# EAGLE design AquModule2 (EAGLE 6.6.0)
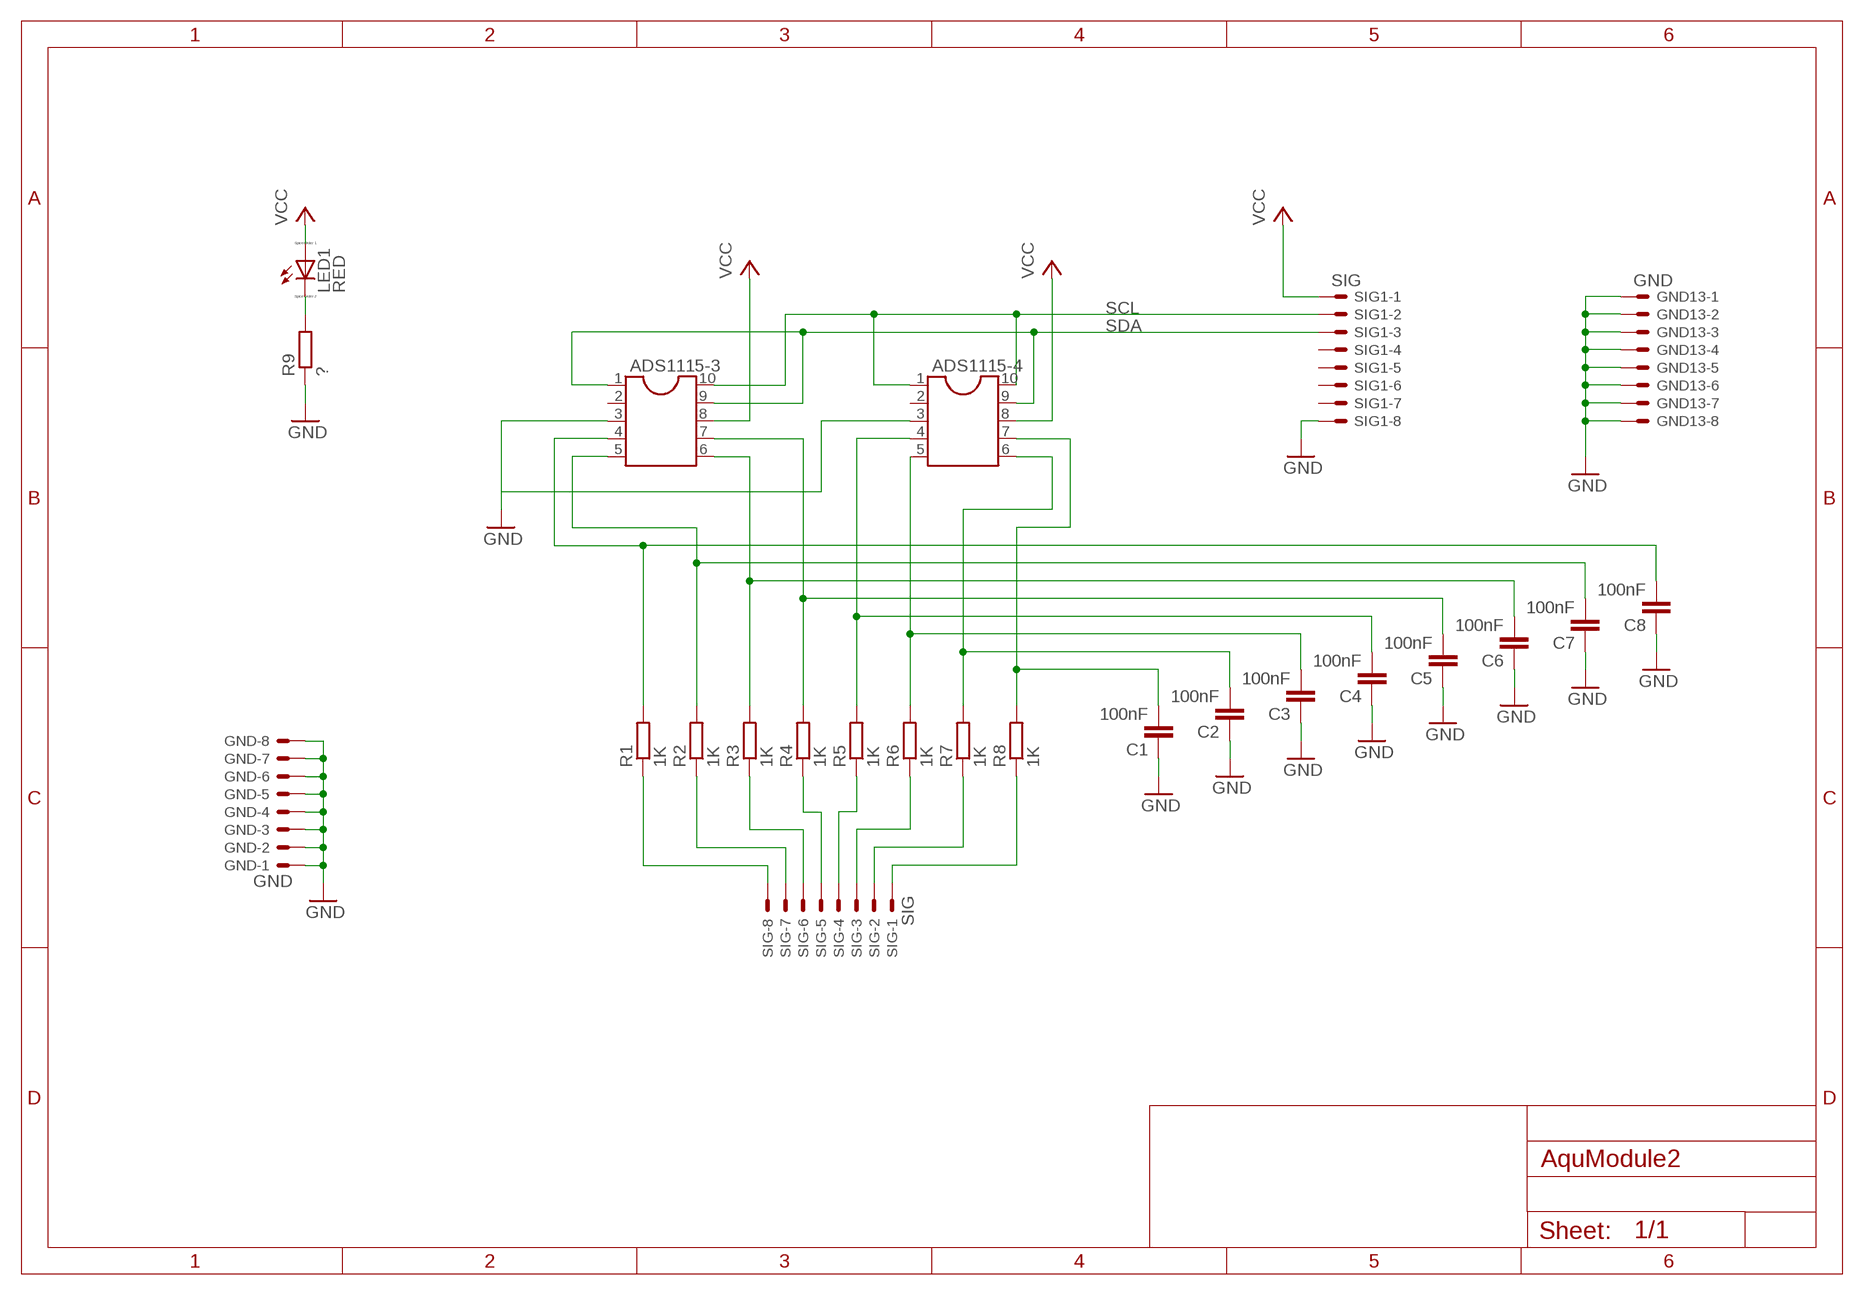
[diagram p0: schematic, sheet 1]

## Parts
ADS1115-3  DIL10  [DIL10]
ADS1115-4  DIL10  [DIL10]
C1  100nF  C-EUC1206  [C1206]
C2  100nF  C-EUC1206  [C1206]
C3  100nF  C-EUC1206  [C1206]
C4  100nF  C-EUC1206  [C1206]
C5  100nF  C-EUC1206  [C1206]
C6  100nF  C-EUC1206  [C1206]
C7  100nF  C-EUC1206  [C1206]
C8  100nF  C-EUC1206  [C1206]
GND  GND  C-GRID-08-15-91  [15-91-08]
GND13  GND  C-GRID-08-15-91  [15-91-08]
LED1  RED  LED_ELD260  [LED_LD260]
R1  1K  R-EU_R1206  [R1206]
R2  1K  R-EU_R1206  [R1206]
R3  1K  R-EU_R1206  [R1206]
R4  1K  R-EU_R1206  [R1206]
R5  1K  R-EU_R1206  [R1206]
R6  1K  R-EU_R1206  [R1206]
R7  1K  R-EU_R1206  [R1206]
R8  1K  R-EU_R1206  [R1206]
R9  ?  R-EU_0207/2V  [0207/2V]
SIG  SIG  C-GRID-08-15-91  [15-91-08]
SIG1  SIG  C-GRID-08-15-91  [15-91-08]

## Nets
GND: ADS1115-3.3 ADS1115-4.3 C1.1 C2.1 C3.1 C4.1 C5.1 C6.1 C7.1 C8.1 GND13.1 GND13.2 GND13.3 GND13.4 GND13.5 GND13.6 GND13.7 GND13.8 GND.1 GND.2 GND.3 GND.4 GND.5 GND.6 GND.7 GND.8 R9.1 SIG1.8
N$1: ADS1115-3.4 C8.2 R1.2
N$2: ADS1115-3.5 C7.2 R2.2
N$3: ADS1115-3.6 C6.2 R3.2
N$4: ADS1115-3.7 C5.2 R4.2
N$5: ADS1115-4.4 C4.2 R5.2
N$6: ADS1115-4.5 C3.2 R6.2
N$7: ADS1115-4.6 C2.2 R7.2
N$8: ADS1115-4.7 C1.2 R8.2
N$9: R1.1 SIG.8
N$10: R2.1 SIG.7
N$11: R3.1 SIG.6
N$12: R4.1 SIG.5
N$13: R5.1 SIG.4
N$14: R6.1 SIG.3
N$15: R7.1 SIG.2
N$16: R8.1 SIG.1
N$17: LED1.K(C) R9.2
SCL: ADS1115-3.10 ADS1115-4.1 ADS1115-4.10 SIG1.2
SDA: ADS1115-3.1 ADS1115-3.9 ADS1115-4.9 SIG1.3
VCC: ADS1115-3.8 ADS1115-4.8 LED1.A SIG1.1
Unconnected: ADS1115-3.2 ADS1115-4.2 SIG1.4 SIG1.5 SIG1.6 SIG1.7

## Library data of the parts
ADS1115-3 ADS1115-4 = ic-package:DIL10: Dual In Line / Socket
C1-C8 = rcl:C-EU: CAPACITOR, European symbol
GND GND13 SIG SIG1 = con-molex:C-GRID-08: CONNECTOR wire to board 2.54 mm (0.100") pitch header; OC_FARNELL: unknown; OC_NEWARK: unknown
LED1 = eagle-ltspice:LED_E: LED Source: http://www.osram.convergy.de Source: www.luxeon.com Source: www.kingbright.com; SPICEMODEL: NONE; SPICEPREFIX: D; SPICETYPE: diode
R1-R9 = resistor:R-EU_: RESISTOR, European symbol

## Board
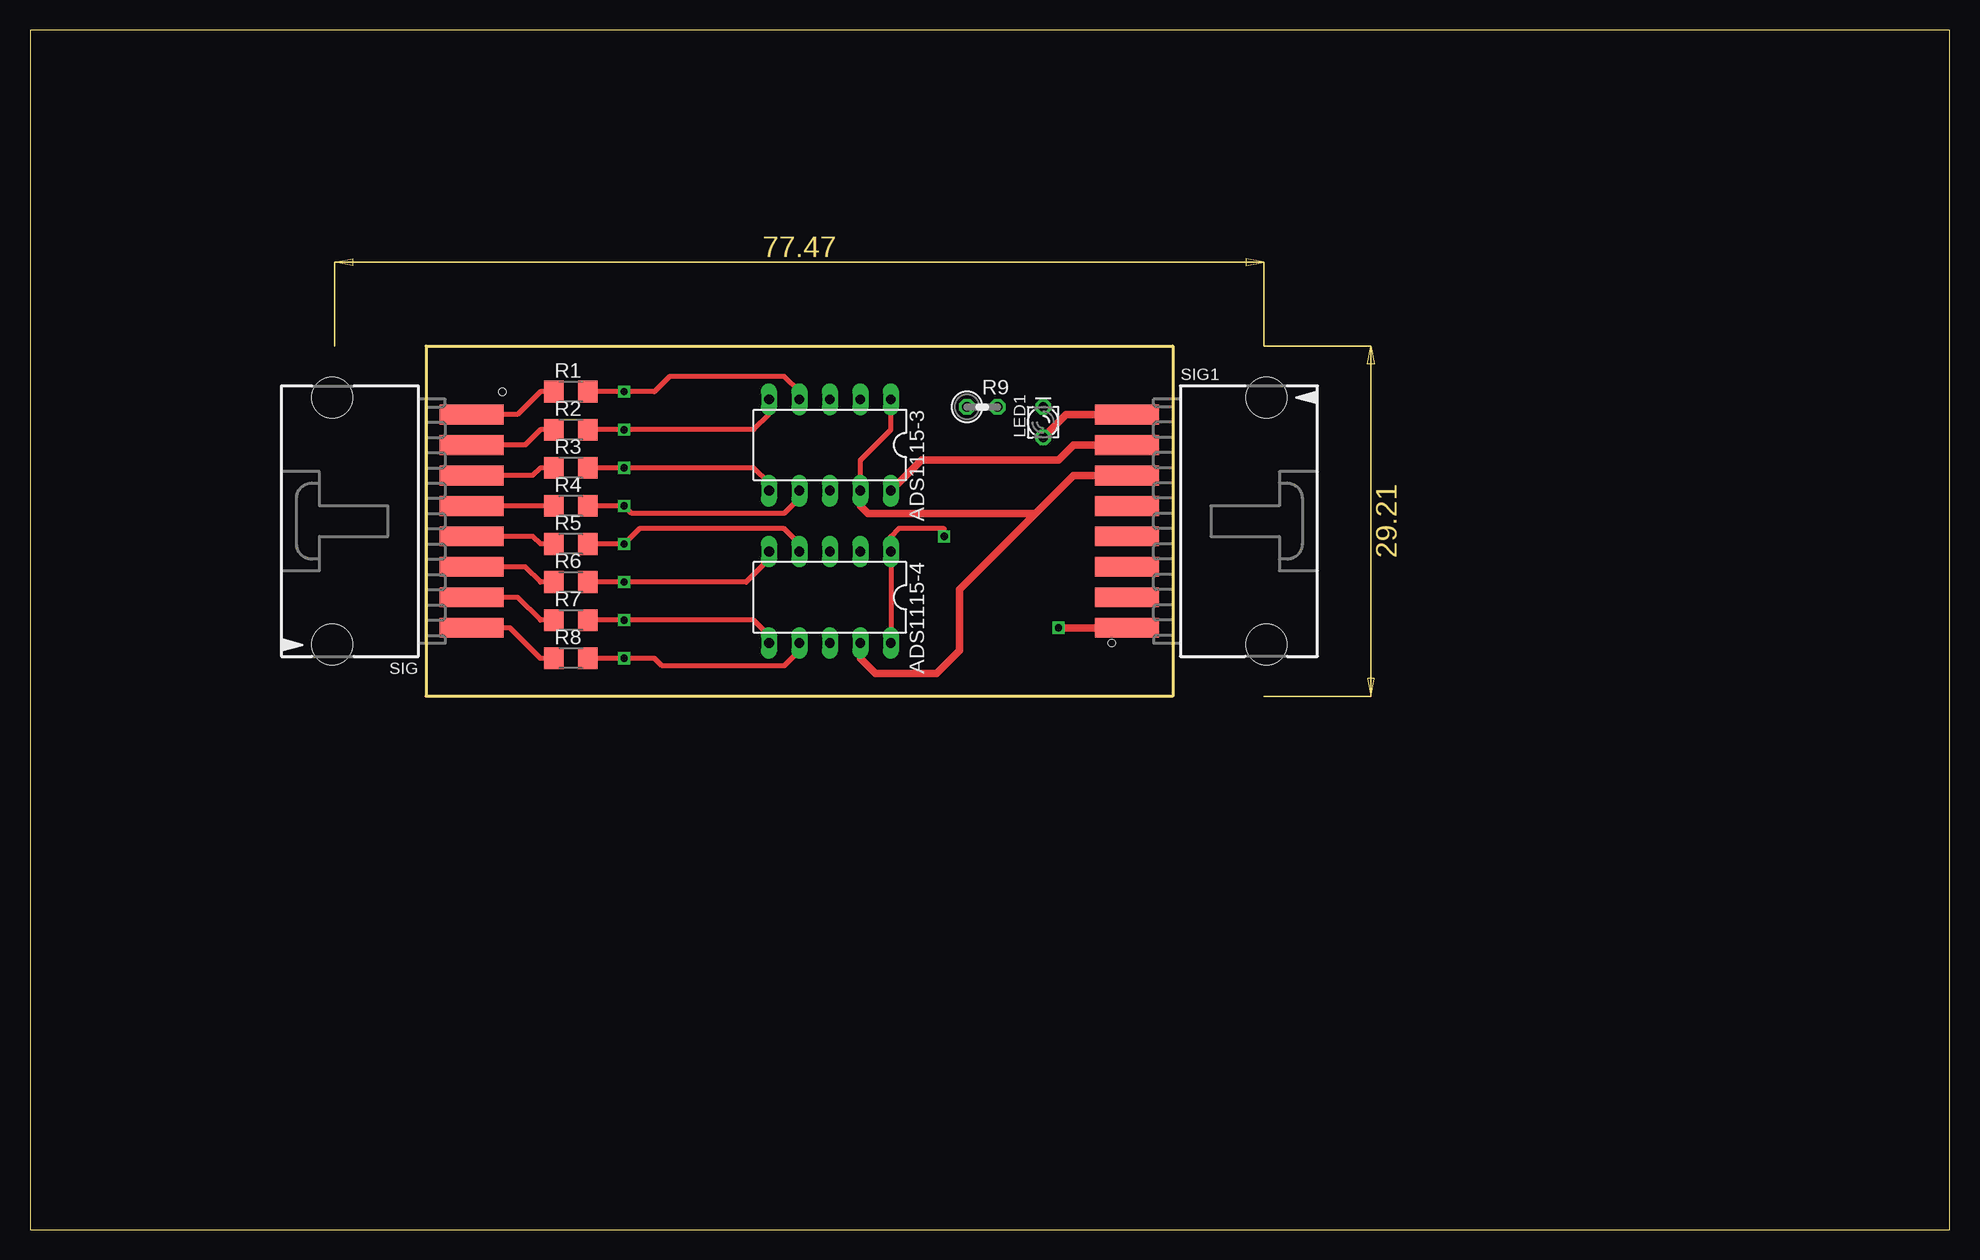
[diagram p1: board, top side]
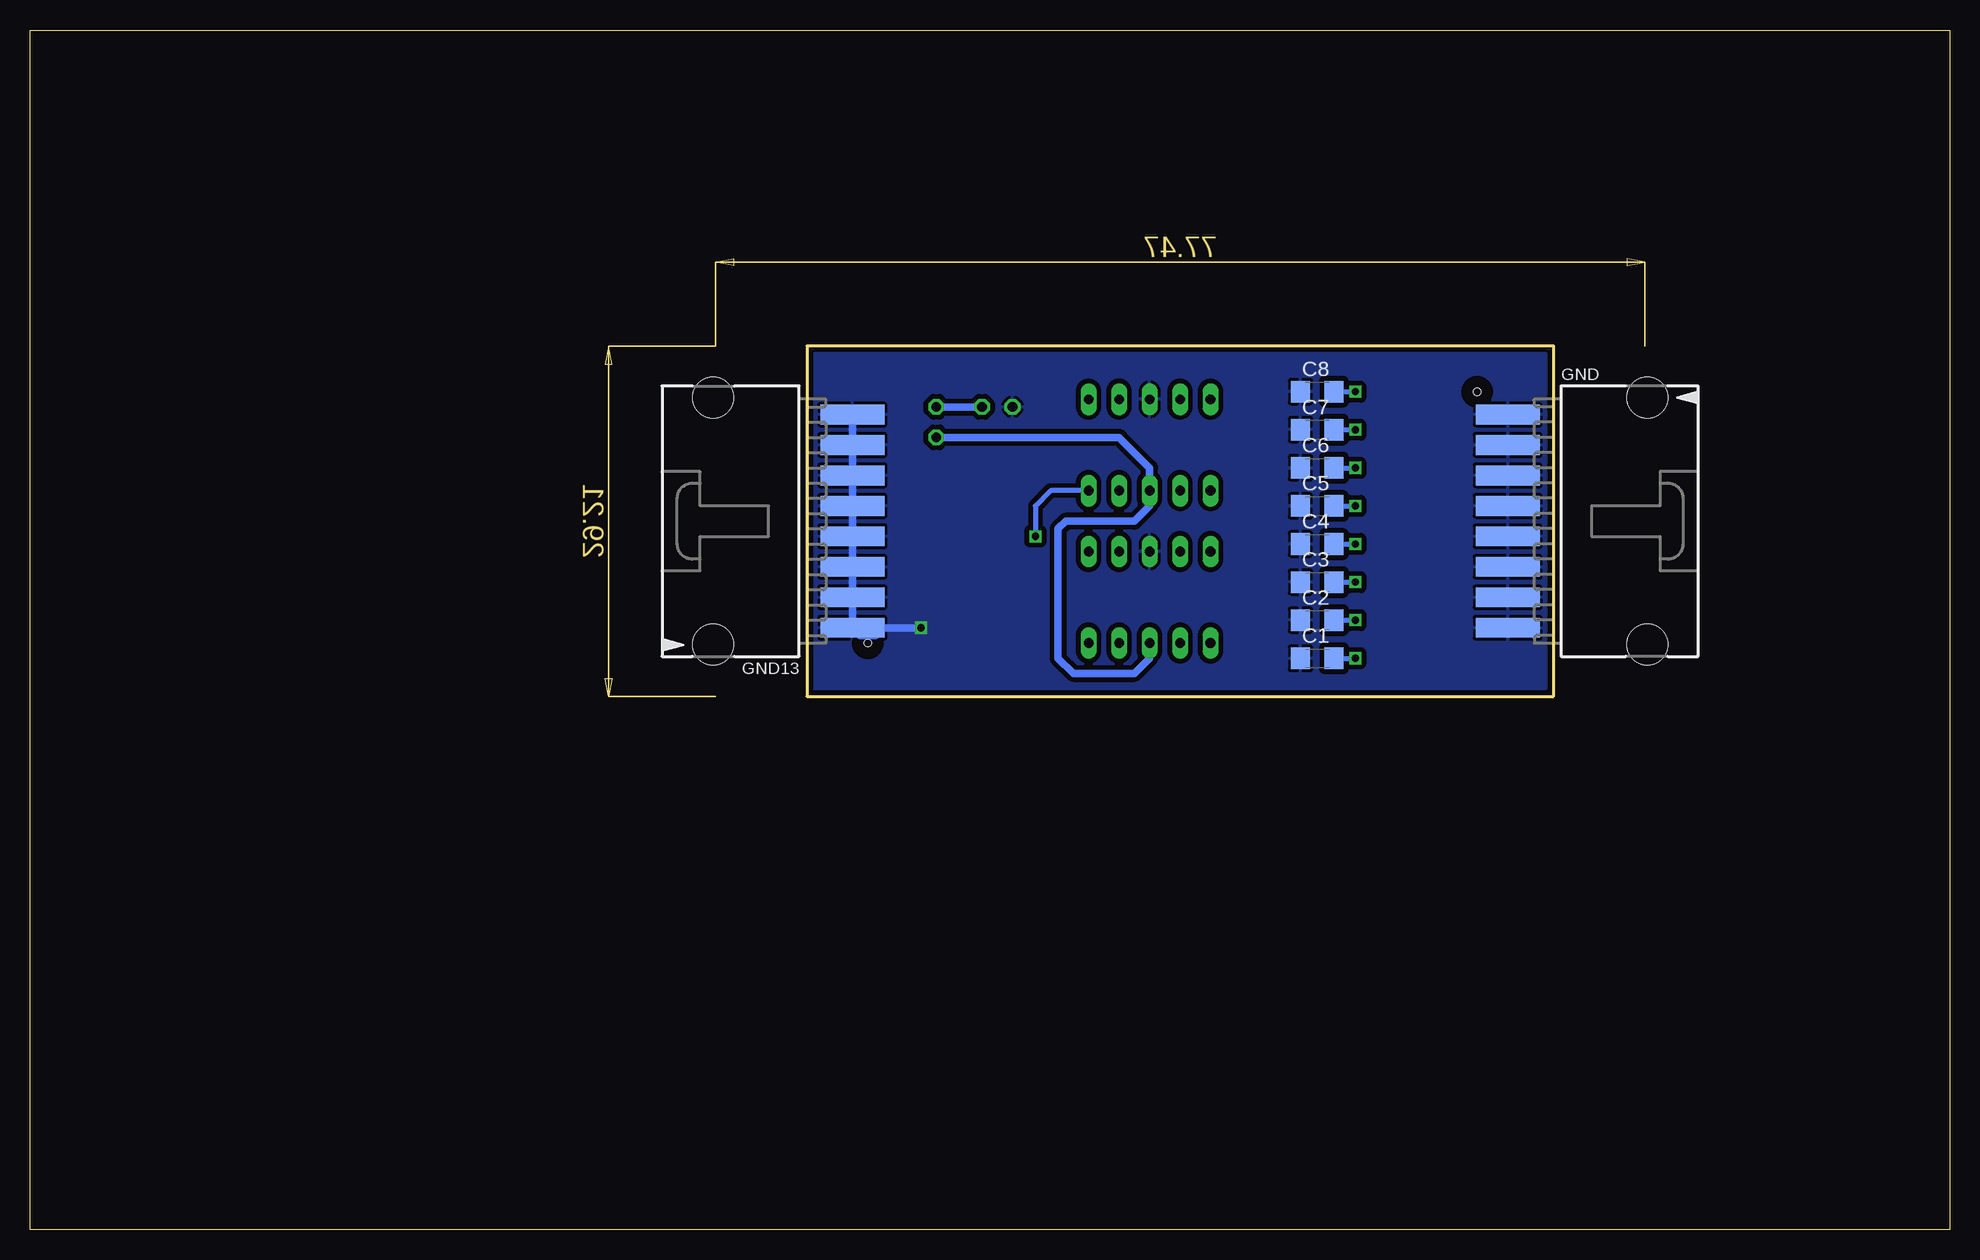
[diagram p2: board, bottom side, seen from below]

Size 160 x 100 mm. Coordinates in mm from the lower left corner, seen from the top.
Outline: 0,0 160,0 160,100 0,100 0,0
Copper layers (1*16): Top 0.035mm / dielectric 1.5mm / Bottom 0.035mm
Design rules "default": minimum track width 10mil, minimum drill 24mil, track to track 8mil, track to pad 8mil, pad to pad 8mil, via to via 8mil, smd to smd 8mil, copper to edge 40mil, drill to drill 8mil, minimum pad ring 10mil, minimum via ring 8mil, stop-mask expansion 4mil, vias tented up to drill 0mil, thermal gap 10mil
Holes 0.6 mm at 39.37,69.85 90.17,48.9
Milling: 4 lines

### Footprints (pad centres in the part's own frame; a part is rotated, then mirrored left to right if it is on the bottom)
DIL10 = drill 0.813 long: 1 -5.08,-3.81; 2 -2.54,-3.81; 3 0,-3.81; 4 2.54,-3.81; 5 5.08,-3.81; 6 5.08,3.81; 7 2.54,3.81; 8 0,3.81; 9 -2.54,3.81; 10 -5.08,3.81
C1206 = smd 1.6 x 1.8: 1 -1.4,0; 2 1.4,0
15-91-08 = smd 1.651 x 5.334: 1 -8.89,-10.795; 2 -6.35,-10.795; 3 -3.81,-10.795; 4 -1.27,-10.795; 5 1.27,-10.795; 6 3.81,-10.795; 7 6.35,-10.795; 8 8.89,-10.795 | hole 3.404: -10.287,0.838; 10.287,0.838
LED_LD260 = drill 0.813 octagon: A -1.27,0; K 1.27,0
R1206 = smd 1.6 x 1.803: 1 -1.422,0; 2 1.422,0
0207/2V = drill 0.813 octagon: 1 -1.27,0; 2 1.27,0

### Placement (x,y rotation side)
ADS1115-3  66.67,65.41 180 top
ADS1115-4  66.67,52.7 180 top
C1  52.7,47.62 0 bottom
C2  52.7,50.8 0 bottom
C3  52.7,53.98 0 bottom
C4  52.7,57.15 0 bottom
C5  52.7,60.33 0 bottom
C6  52.7,63.5 0 bottom
C7  52.7,66.67 0 bottom
C8  52.7,69.85 0 bottom
GND  26.04,59.05 270 bottom
GND13  102.23,59.05 90 bottom
LED1  84.45,67.31 90 top
R1  45.09,69.85 0 top
R2  45.09,66.67 0 top
R3  45.09,63.5 0 top
R4  45.09,60.33 0 top
R5  45.09,57.15 0 top
R6  45.09,53.98 0 top
R7  45.09,50.8 0 top
R8  45.09,47.62 0 top
R9  79.38,68.58 0 top
SIG  26.04,59.05 90 top
SIG1  102.23,59.05 270 top

### Tracks (layer width: path | path; a pad name or v marks a point on that pad's centre or on a via)
GND  (via drill 0.6)
  Top 0.61: v85.72,50.16 GND13.1
  Bottom 0.61: GND13.8 GND13.7 GND13.6 GND13.5 GND13.4 | 91.44,57.15 GND13.4 | GND13.4 GND13.3 GND13.2 GND13.1 | GND13.1 90.81,49.53 89.53,49.53 88.9,50.16 | GND13.1 v85.72,50.16
  pour Bottom (isolate 0.406): 33.66,73.03 94.61,73.03 94.61,45.09 33.66,45.09
N$1  (via drill 0.6)
  Top 0.406: R1.2 v49.53,69.85 52.05,69.85 53.33,71.12 62.87,71.12 64.14,69.85 ADS1115-3.4
  Bottom 0.406: C8.2 v49.53,69.85
N$2  (via drill 0.6)
  Top 0.406: R2.2 v49.53,66.67 60.33,66.67 61.59,67.94 ADS1115-3.5
  Bottom 0.406: C7.2 v49.53,66.67
N$3  (via drill 0.6)
  Top 0.406: R3.2 v49.53,63.5 60.33,63.5 61.59,62.23 ADS1115-3.6
  Bottom 0.406: C6.2 v49.53,63.5
N$4  (via drill 0.6)
  Top 0.406: R4.2 v49.53,60.33 50.16,59.69 62.87,59.69 64.14,60.96 ADS1115-3.7
  Bottom 0.406: C5.2 v49.53,60.33
N$5  (via drill 0.6)
  Top 0.406: R5.2 v49.53,57.15 50.8,58.42 62.87,58.42 64.14,57.15 ADS1115-4.4
  Bottom 0.406: C4.2 v49.53,57.15
N$6  (via drill 0.6)
  Top 0.406: R6.2 v49.53,53.98 59.69,53.98 61.59,55.88 ADS1115-4.5
  Bottom 0.406: C3.2 v49.53,53.98
N$7  (via drill 0.6)
  Top 0.406: R7.2 v49.53,50.8 60.33,50.8 61.59,49.53 ADS1115-4.6
  Bottom 0.406: C2.2 v49.53,50.8
N$8  (via drill 0.6)
  Top 0.406: R8.2 v49.53,47.62 52.05,47.62 52.69,46.99 62.87,46.99 64.14,48.26 ADS1115-4.7
  Bottom 0.406: C1.2 v49.53,47.62
N$9
  Top 0.406: R1.1 42.55,69.85 40.64,67.94 SIG.8
N$10
  Top 0.406: R2.1 42.55,66.67 41.27,65.41 SIG.7
N$11
  Top 0.406: R3.1 42.55,63.5 41.91,62.87 SIG.6
N$12
  Top 0.406: R4.1 SIG.5
N$13
  Top 0.406: R5.1 42.55,57.15 41.91,57.78 SIG.4
N$14
  Top 0.406: R6.1 42.55,53.98 41.27,55.24 SIG.3
N$15
  Top 0.406: R7.1 42.55,50.8 40.64,52.7 SIG.2
N$16
  Top 0.406: R8.1 42.55,47.62 40.01,50.16 SIG.1
N$17
  Bottom 0.61: LED1.K R9.2
SCL  (via drill 0.6)
  Top 0.406: ADS1115-4.10 ADS1115-4.1 71.75,57.78 72.39,58.42 76.2,58.42 v76.2,57.78
  Top 0.61: SIG1.2 87,65.41 85.72,64.14 74.3,64.14 ADS1115-3.10
  Bottom 0.406: ADS1115-3.10 74.93,61.59 76.2,60.33 v76.2,57.78
SDA
  Top 0.406: ADS1115-3.9 69.22,64.14 71.75,66.67 ADS1115-3.1
  Top 0.61: ADS1115-3.9 69.22,60.33 69.85,59.69 83.82,59.69 | 83.82,59.69 87,62.87 SIG1.3 | ADS1115-4.9 69.22,47.62 70.48,46.35 75.56,46.35 77.47,48.26 77.47,53.34 83.82,59.69
VCC
  Top 0.61: SIG1.1 86.36,67.94 LED1.A
  Bottom 0.61: ADS1115-4.8 66.67,47.62 67.94,46.35 73.03,46.35 74.3,47.62 74.3,58.42 73.66,59.05 67.94,59.05 66.67,60.33 ADS1115-3.8 66.67,63.5 69.22,66.04 LED1.A